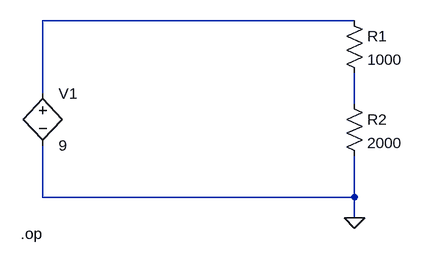
[diagram p0: schematic VoltageDivider.asc]
VoltageDivider.asc, the LTspice schematic file:
Version 4
SHEET 1 880 680
WIRE 240 -256 -240 -256
WIRE -240 -144 -240 -256
WIRE 240 -128 240 -176
WIRE -240 16 -240 -64
WIRE 240 16 240 -48
WIRE 240 16 -240 16
WIRE 240 48 240 16
FLAG 240 48 0
SYMBOL h -240 -160 R0
WINDOW 123 0 0 Left 0
WINDOW 39 0 0 Left 0
SYMATTR InstName V1
SYMATTR Value 9
SYMATTR Prefix V
SYMBOL res 224 -272 R0
SYMATTR InstName R1
SYMATTR Value 1000
SYMBOL res 224 -144 R0
SYMATTR InstName R2
SYMATTR Value 2000
TEXT -274 72 Left 2 !.op

The netlist it stands for:
* VoltageDivider.asc
V1 N001 0 9
R1 N001 N002 1000
R2 N002 0 2000
.op
.backanno
.end